# Altium schematic sheet processor_beaglebone.SchDoc
size A4; Organization: Badgerloop; Address1: 133 Engineering Research; Address2: Building; Address3: Madison, WI 53715; SheetNumber: X; SheetTotal: Y
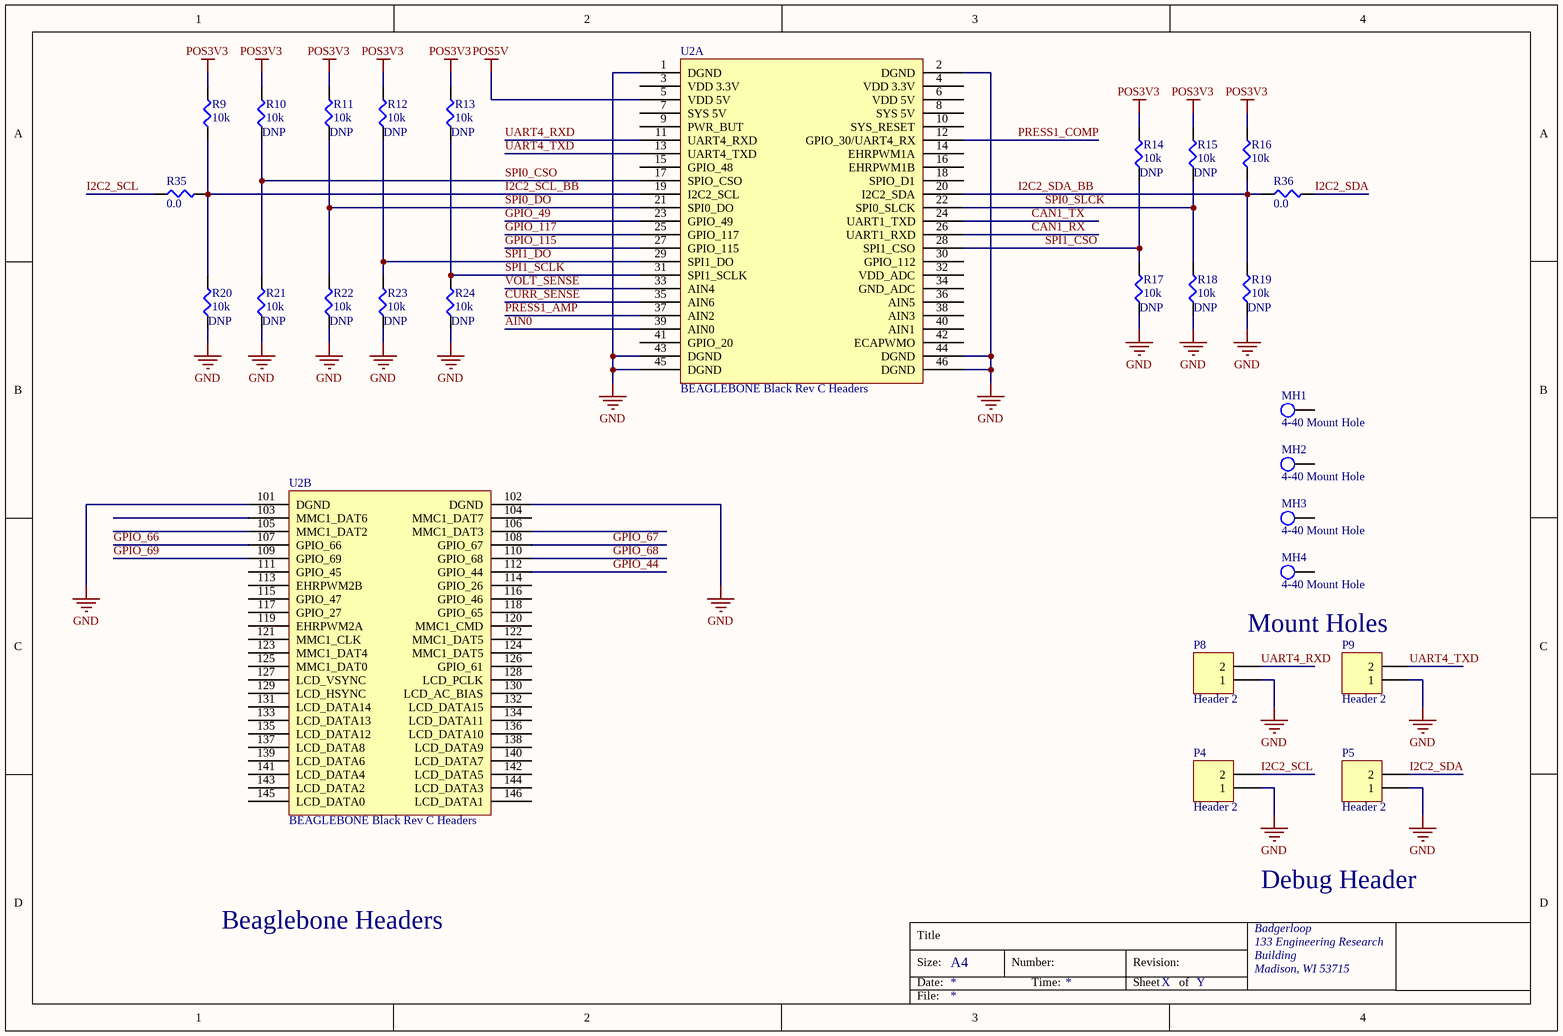
[diagram p0: processor_beaglebone.SchDoc]

## Parts
MH1  4-40 Mount Hole  [MH]
MH2  4-40 Mount Hole  [MH]
MH3  4-40 Mount Hole  [MH]
MH4  4-40 Mount Hole  [MH]
P4  Header 2  [Pin Header 1x2 TH Pitch 2.54mm]
P5  Header 2  [Pin Header 1x2 TH Pitch 2.54mm]
P8  Header 2  [Pin Header 1x2 TH Pitch 2.54mm]
P9  Header 2  [Pin Header 1x2 TH Pitch 2.54mm]
R9  10k  [SMD-0402-RES]
R10  10k  [SMD-0402-RES]
R11  10k  [SMD-0402-RES]
R12  10k  [SMD-0402-RES]
R13  10k  [SMD-0402-RES]
R14  10k  [SMD-0402-RES]
R15  10k  [SMD-0402-RES]
R16  10k  [SMD-0402-RES]
R17  10k  [SMD-0402-RES]
R18  10k  [SMD-0402-RES]
R19  10k  [SMD-0402-RES]
R20  10k  [SMD-0402-RES]
R21  10k  [SMD-0402-RES]
R22  10k  [SMD-0402-RES]
R23  10k  [SMD-0402-RES]
R24  10k  [SMD-0402-RES]
R35  0.0  [SMD-0402-RES]
R36  0.0  [SMD-0402-RES]
U2  BEAGLEBONE Black Rev C Headers  [Beaglebone_Topside]  (parts A,B of 2)

## Nets
GND: P4.1 P5.1 P8.1 P9.1 R17.1 R18.1 R19.1 R20.1 R21.1 R22.1 R23.1 R24.1 U2.1(DGND) U2.2(DGND) U2.43(DGND) U2.44(DGND) U2.45(DGND) U2.46(DGND) U2.101(DGND) U2.102(DGND)
POS3V3: R9.2 R10.2 R11.2 R12.2 R13.2 R14.2 R15.2 R16.2
POS5V: U2.5(VDD_5V)
AIN0: U2.39(AIN0)
CAN1_RX: U2.26(UART1_RXD)
CAN1_TX: U2.24(UART1_TXD)
CURR_SENSE: U2.35(AIN6)
GPIO_44: U2.112(GPIO_44)
GPIO_49: U2.23(GPIO_49)
GPIO_66: U2.107(GPIO_66)
GPIO_67: U2.108(GPIO_67)
GPIO_68: U2.110(GPIO_68)
GPIO_69: U2.109(GPIO_69)
GPIO_115: U2.27(GPIO_115)
GPIO_117: U2.25(GPIO_117)
I2C2_SCL: P4.2 R35.1
I2C2_SCL_BB: R9.1 R20.2 R35.2 U2.19(I2C2_SCL)
I2C2_SDA: P5.2 R36.2
I2C2_SDA_BB: R16.1 R19.2 R36.1 U2.20(I2C2_SDA)
PRESS1_AMP: U2.37(AIN2)
PRESS1_COMP: U2.12(GPIO_30/UART4_RX)
SPI0_CSO: R10.1 R21.2 U2.17(SPIO_CSO)
SPI0_DO: R11.1 R22.2 U2.21(SPI0_DO)
SPI0_SLCK: R15.1 R18.2 U2.22(SPI0_SLCK)
SPI1_CSO: R14.1 R17.2 U2.28(SPI1_CSO)
SPI1_DO: R12.1 R23.2 U2.29(SPI1_DO)
SPI1_SCLK: R13.1 R24.2 U2.31(SPI1_SCLK)
UART4_RXD: P8.2 U2.11(UART4_RXD)
UART4_TXD: P9.2 U2.13(UART4_TXD)
VOLT_SENSE: U2.33(AIN4)

Not connected (* = marked no-connect by the designer): MH1 46; MH2 46; MH3 46; MH4 46; U2 3(VDD_3.3V) 4(VDD_3.3V) 6(VDD_5V) 7(SYS_5V) 8(SYS_5V) 9(PWR_BUT) 10(SYS_RESET) 14(EHRPWM1A) 15(GPIO_48) 16(EHRPWM1B) 18(SPIO_D1) 30(GPIO_112) 32(VDD_ADC) 34(GND_ADC) 36(AIN5) 38(AIN3) 40(AIN1) 41(GPIO_20) 42(ECAPWMO) 103(MMC1_DAT6) 104(MMC1_DAT7) 105(MMC1_DAT2) 106(MMC1_DAT3) 111(GPIO_45) 113(EHRPWM2B) 114(GPIO_26) 115(GPIO_47) 116(GPIO_46) 117(GPIO_27) 118(GPIO_65) 119(EHRPWM2A) 120(MMC1_CMD) 121(MMC1_CLK) 122(MMC1_DAT5) 123(MMC1_DAT4) 124(MMC1_DAT5) 125(MMC1_DAT0) 126(GPIO_61) 127(LCD_VSYNC) 128(LCD_PCLK) 129(LCD_HSYNC) 130(LCD_AC_BIAS) 131(LCD_DATA14) 132(LCD_DATA15) 133(LCD_DATA13) 134(LCD_DATA11) 135(LCD_DATA12) 136(LCD_DATA10) 137(LCD_DATA8) 138(LCD_DATA9) 139(LCD_DATA6) 140(LCD_DATA7) 141(LCD_DATA4) 142(LCD_DATA5) 143(LCD_DATA2) 144(LCD_DATA3) 145(LCD_DATA0) 146(LCD_DATA1)

## Notes on the sheet
- Mount Holes
- Debug Header
- Beaglebone Headers
- Title
- Size:
- Date:
- A4
- Number:
- Time:
- Revision:
- Sheet
- of
- File:

## Library data of the parts
P4 P5 P8 P9 = Header 2: Header, 2-Pin; LatestRevisionDate: 17-Jul-2002; LatestRevisionNote: Re-released for DXP Platform.; Publisher: Altium Limited
R9-R24 = ERJ-2GEJ103X: RES SMD 10K OHM 5% 1/10W 0402; Manufacturer: Panasonic Electronic Components; Factory Stock: 0; Unit Price (USD): 0.00350; @ qty: 1500; Minimum Quantity: 1; Power (Watts): 0.1W, 1/10W; Temperature Coefficient: ±200ppm/°C; Part Number: ERJ-2GEJ103X; Datasheets: http://industrial.panasonic.com/www-cgi/jvcr13pz.cgi?E+PZ+3+AOA0001+ERJ2GEJ103X+7+WW; Image: //media.digikey.com/Photos/Panasonic%20Photos/ERJ-PA2-Series.jpg; Digi-Key Part Number: P10KJCT-ND; Quantity Available: 2560215; Packaging: Cut Tape (CT); Series: ERJ; Part Status: Active; Value: 10k; Tolerance: ±5%; Composition: Thick Film; Features: Automotive AEC-Q200; Operating Temperature: -55°C ~ 155°C; Package / Case: 0402 (1005 Metric); Supplier Device Package: 0402; Size / Dimension: 0.039" L x 0.020" W (1.00mm x 0.50mm); Height - Seated (Max): 0.016" (0.40mm); Number of Terminations: 2; Failure Rate: -
  R10-R15 R17-R24: DNP: DNP
R35 R36 = ERJ-2GE0R00X: RES SMD 0.0OHM JUMPER 1/10W 0402; Manufacturer: Panasonic Electronic Components; Factory Stock: 0; Unit Price (USD): 0.00384; @ qty: 1500; Minimum Quantity: 1; Power (Watts): 0.1W, 1/10W; Part Number: ERJ-2GE0R00X; Datasheets: http://industrial.panasonic.com/www-cgi/jvcr13pz.cgi?E+PZ+3+AOA0001+ERJ2GE0R00X+7+WW; Image: //media.digikey.com/Photos/Panasonic%20Photos/ERJ-PA2-Series.jpg; Digi-Key Part Number: P0.0JCT-ND; Quantity Available: 3152483; Packaging: Cut Tape (CT); Series: ERJ; Part Status: Active; Value: 0.0; Tolerance: Jumper; Composition: Thick Film; Features: Automotive AEC-Q200; Temperature Coefficient: -; Operating Temperature: -55°C ~ 155°C; Package / Case: 0402 (1005 Metric); Supplier Device Package: 0402; Size / Dimension: 0.039" L x 0.020" W (1.00mm x 0.50mm); Height - Seated (Max): 0.016" (0.40mm); Number of Terminations: 2; Failure Rate: -
U2 = Beaglebone: Beaglebone Black Rev C Header